# Altium schematic sheet uMultimeter_ExpIO_Sch.SchDoc: MicroMultimeter_ExpIO
size 127 x 101 mm; Author: Hom; CompanyName: KitSprout; DrawnBy: Hom; Engineer: Hom; Organization: KitSprout; Revision: A; SheetNumber: 1; SheetTotal: 1; License: CC BY-SA 4.0; Version: 1.0; LibVersion: 1.4; PageSetup: Record=PageOptions|CenterHorizontal=True|CenterVertical=True|PrintScale=1.00|XCorrection=1.00|YCorrection=1.00|PrintKind=0|BorderSize=5000000|LeftOffset=0|BottomOffset=0|Orientation=2|PaperLength=1000|PaperWidth=1000|Scale=100|PaperSource=7|PrintQuality=-3|MediaType=1|DitherType=10|PrintScaleMode=0|PaperKind=A4|PaperIndex=9
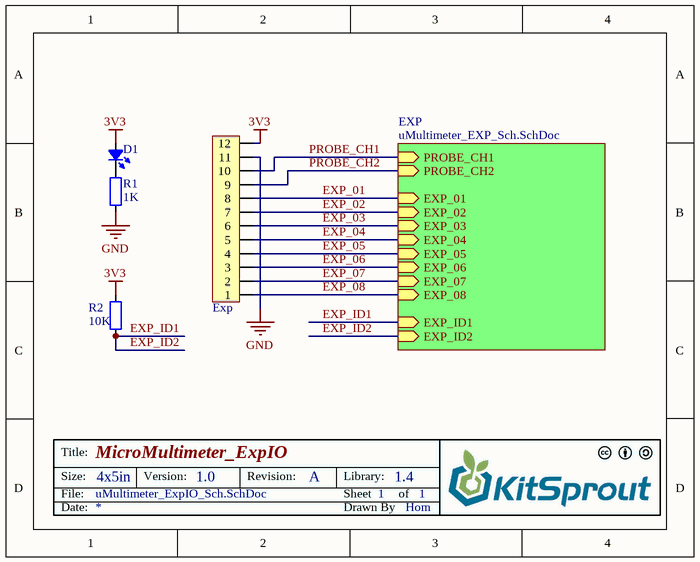
[diagram p0: uMultimeter_ExpIO_Sch.SchDoc]

## Parts
D1  LED_0805  [LED_0805_BLUE]  (value not drawn)
Exp  HDR1x12_2.54  [HDR1X12_2.54_180H]  (value not drawn)
R1  value 1K  [RES_0603]  (hidden comment: Res_0603)
R2  value 10K  [RES_0603]  (hidden comment: Res_0603)

## Sub-sheets
EXP = uMultimeter_EXP_Sch.SchDoc: PROBE_CH1 (in), PROBE_CH2 (in), EXP_01 (in), EXP_02 (in), EXP_03 (in), EXP_04 (in), EXP_05 (in), EXP_06 (in), EXP_07 (in), EXP_08 (in), EXP_ID1 (in), EXP_ID2 (in)

## Nets
3V3: D1.1(A) Exp.12 R2.1
GND: Exp.11 R1.2
EXP_01: Exp.8 ; sheet EXP/EXP_01
EXP_02: Exp.7 ; sheet EXP/EXP_02
EXP_03: Exp.6 ; sheet EXP/EXP_03
EXP_04: Exp.5 ; sheet EXP/EXP_04
EXP_05: Exp.4 ; sheet EXP/EXP_05
EXP_06: Exp.3 ; sheet EXP/EXP_06
EXP_07: Exp.2 ; sheet EXP/EXP_07
EXP_08: Exp.1 ; sheet EXP/EXP_08
EXP_ID1: R2.2 ; sheet EXP/EXP_ID1, sheet EXP/EXP_ID2  [also labelled EXP_ID2]
PROBE_CH1: Exp.10 ; sheet EXP/PROBE_CH1
PROBE_CH2: Exp.9 ; sheet EXP/PROBE_CH2
NetD1_2: D1.2(K) R1.1

## Notes on the sheet
- Title:
- Size:
- Date:
- File:
- 4x5in
- Version:
- Revision:
- Sheet
- Drawn By
- Library:
- of

## Library data of the parts
D1 = LED_0805: LED
Exp = HDR1x12_2.54: Header
R1 R2 = Res_0603: Resistor